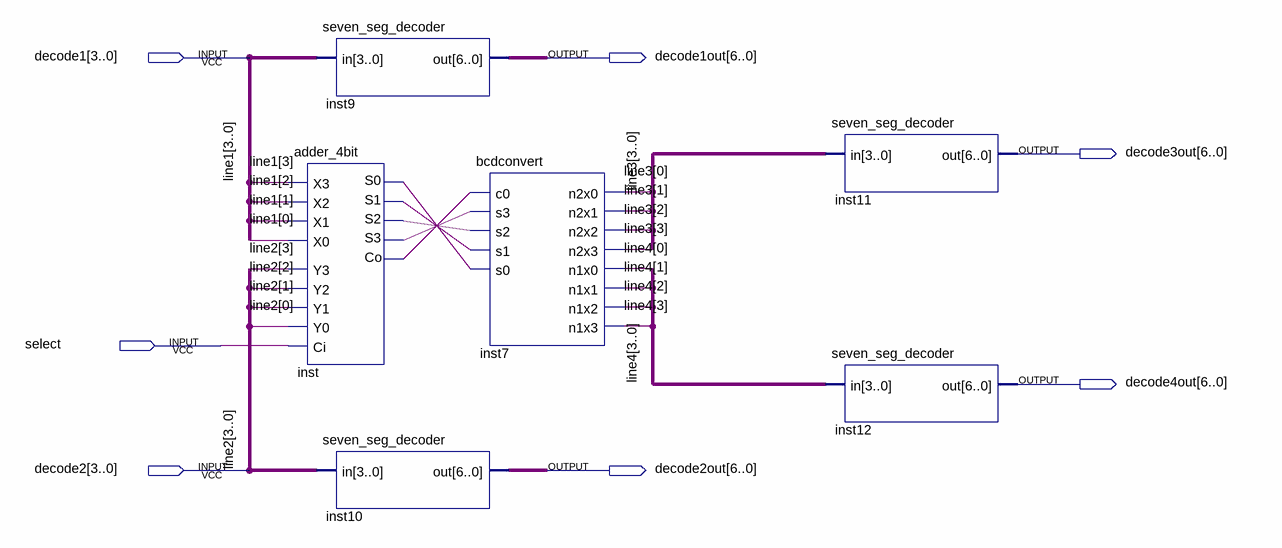
[diagram p0: schematic sheet]
// Quartus schematic lab06.bdf as structural Verilog: 6 symbols, 7 pins
module lab06 (
  input  [3:0] decode1,
  input  select,
  input  [3:0] decode2,
  output [6:0] decode1out,
  output [6:0] decode3out,
  output [6:0] decode4out,
  output [6:0] decode2out
);

  wire inst_co, inst_s0, inst_s1, inst_s2, inst_s3;
  wire [3:0] line3, line4;

  adder_4bit inst (
    .X3(decode1[3]), .Y3(decode2[3]), .X2(decode1[2]), .Y2(decode2[2]), .X1(decode1[1]), .Y1(decode2[1]),
    .X0(decode1[0]), .Y0(decode2[0]), .Ci(select), .S0(inst_s0), .S1(inst_s1), .S2(inst_s2), .S3(inst_s3),
    .Co(inst_co));
  seven_seg_decoder inst9 (.in(decode1), .out(decode1out));
  seven_seg_decoder inst10 (.in(decode2), .out(decode2out));
  bcdconvert inst7 (
    .c0(inst_co), .s3(inst_s3), .s2(inst_s2), .s1(inst_s1), .s0(inst_s0), .n2x0(line3[0]), .n2x1(line3[1]),
    .n2x2(line3[2]), .n2x3(line3[3]), .n1x0(line4[0]), .n1x1(line4[1]), .n1x2(line4[2]), .n1x3(line4[3]));
  seven_seg_decoder inst11 (.in(line3), .out(decode3out));
  seven_seg_decoder inst12 (.in(line4), .out(decode4out));

  // Other names for the same wires on the sheet: line1[3:0] = decode1; line2[3:0] = decode2
endmodule
